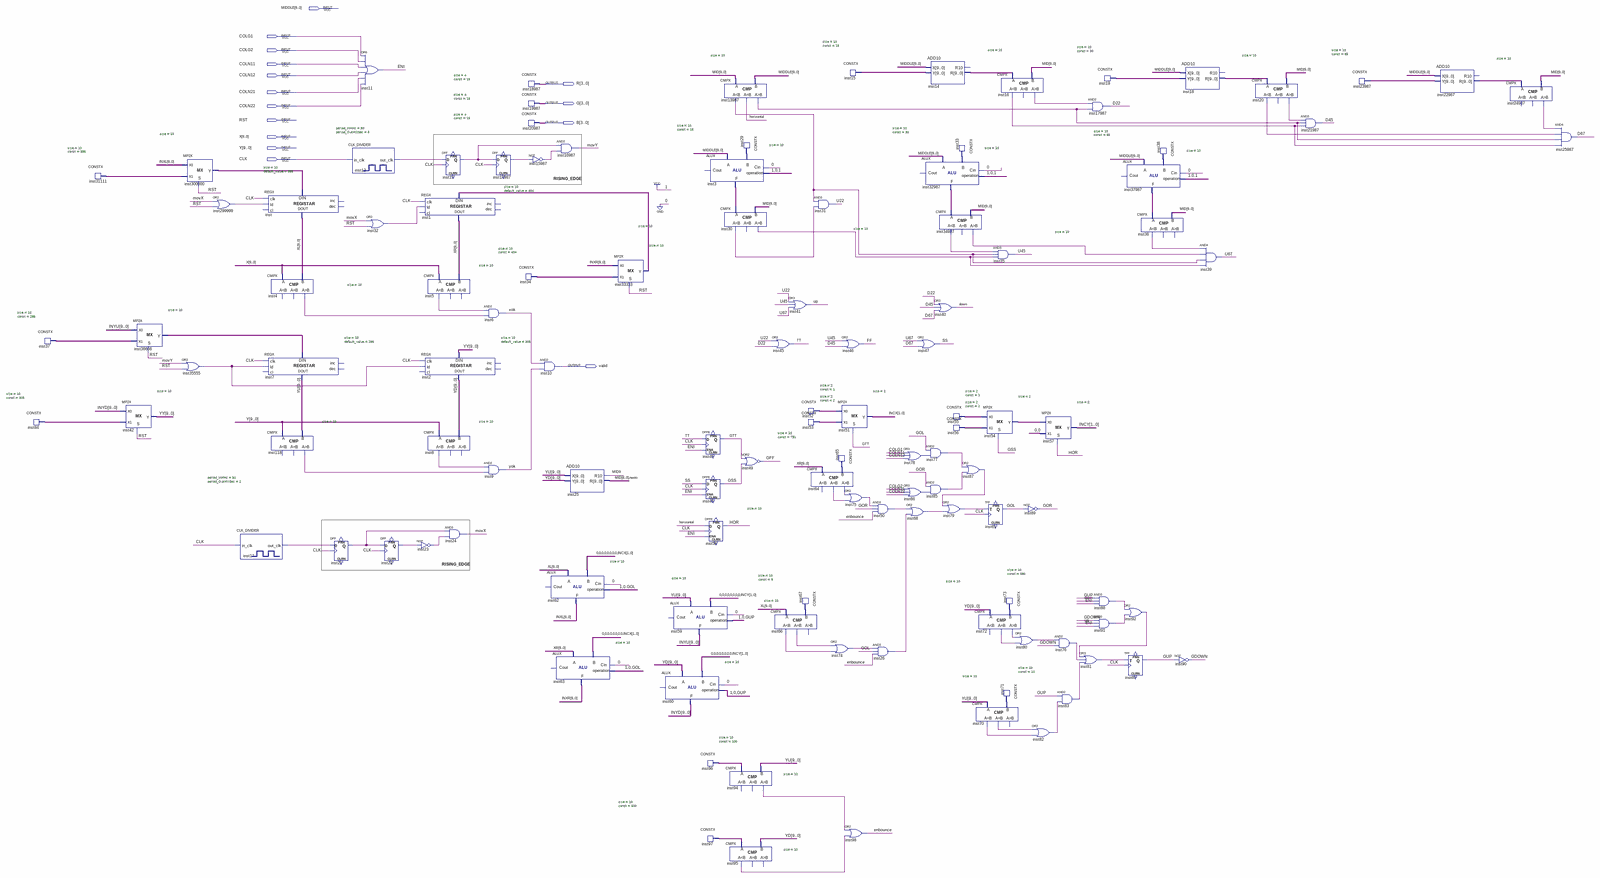
[diagram p0: schematic sheet, whole]
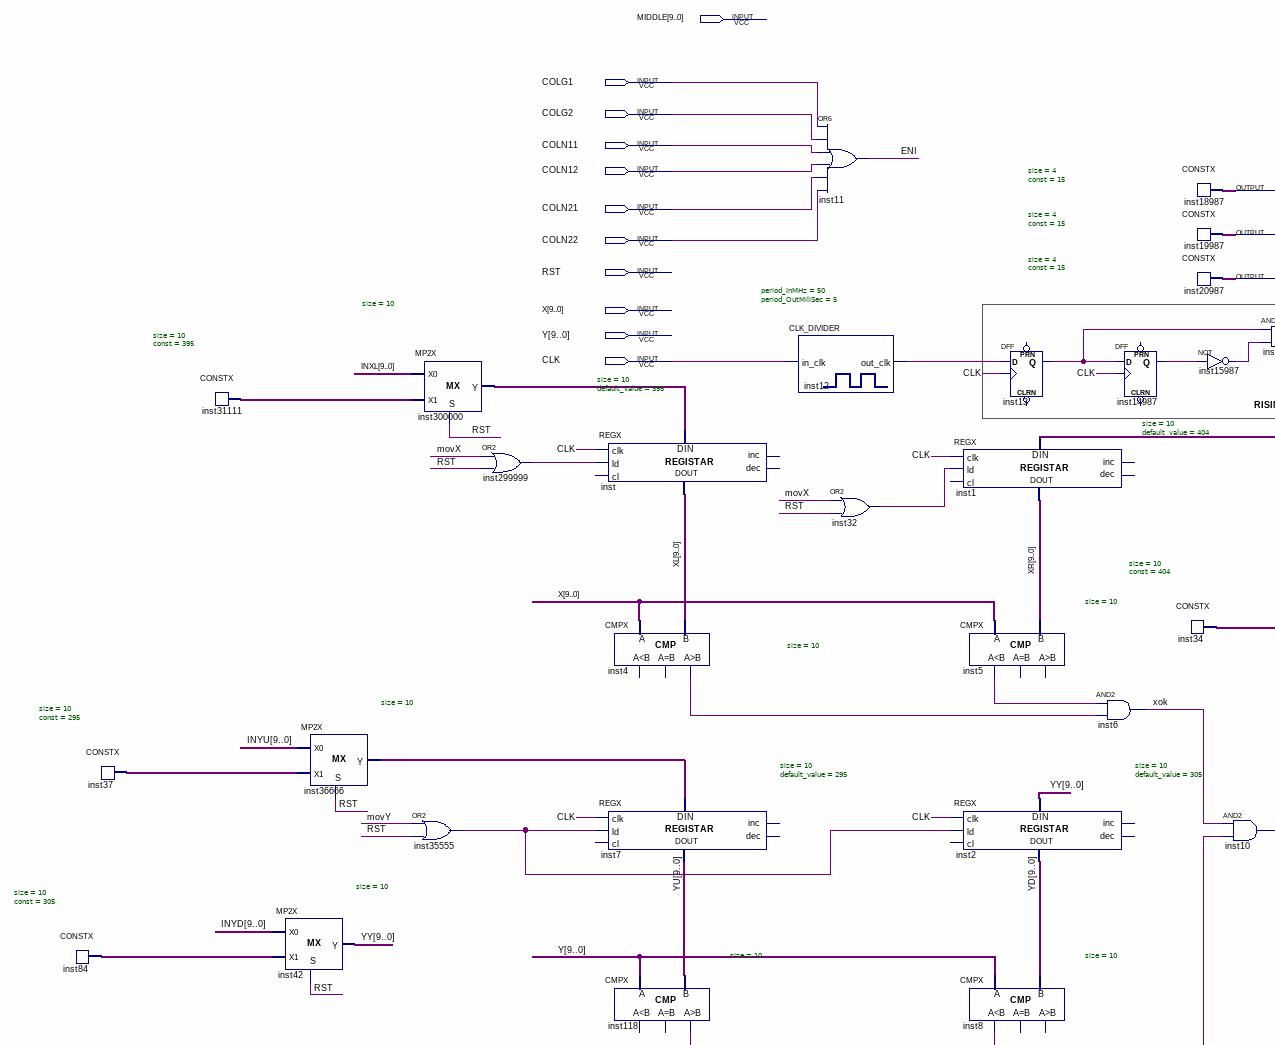
[diagram p1: schematic sheet, upper left part]
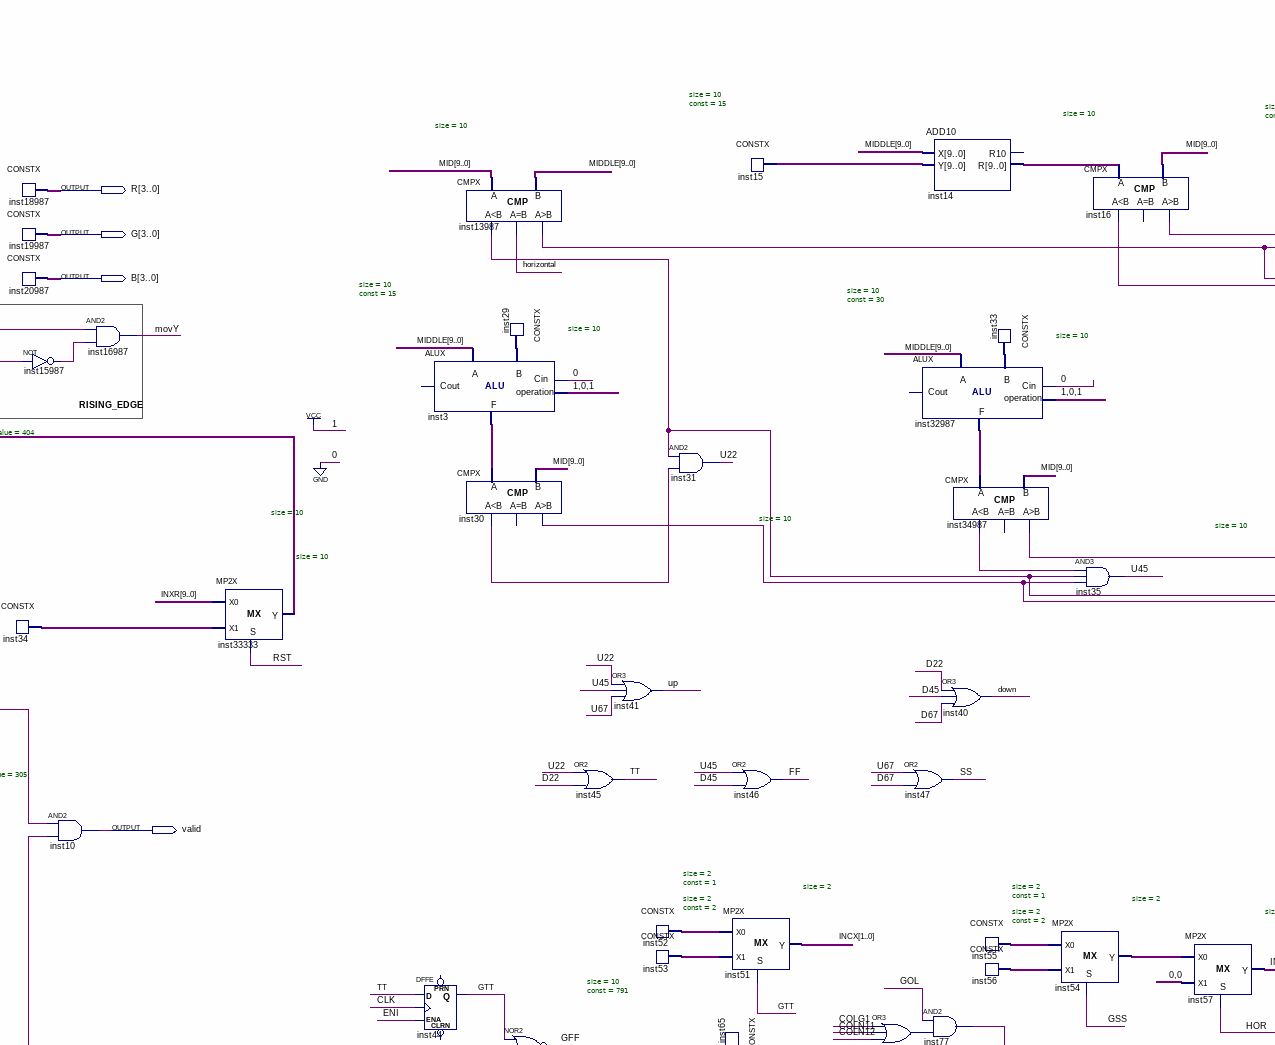
[diagram p2: schematic sheet, upper centre part]
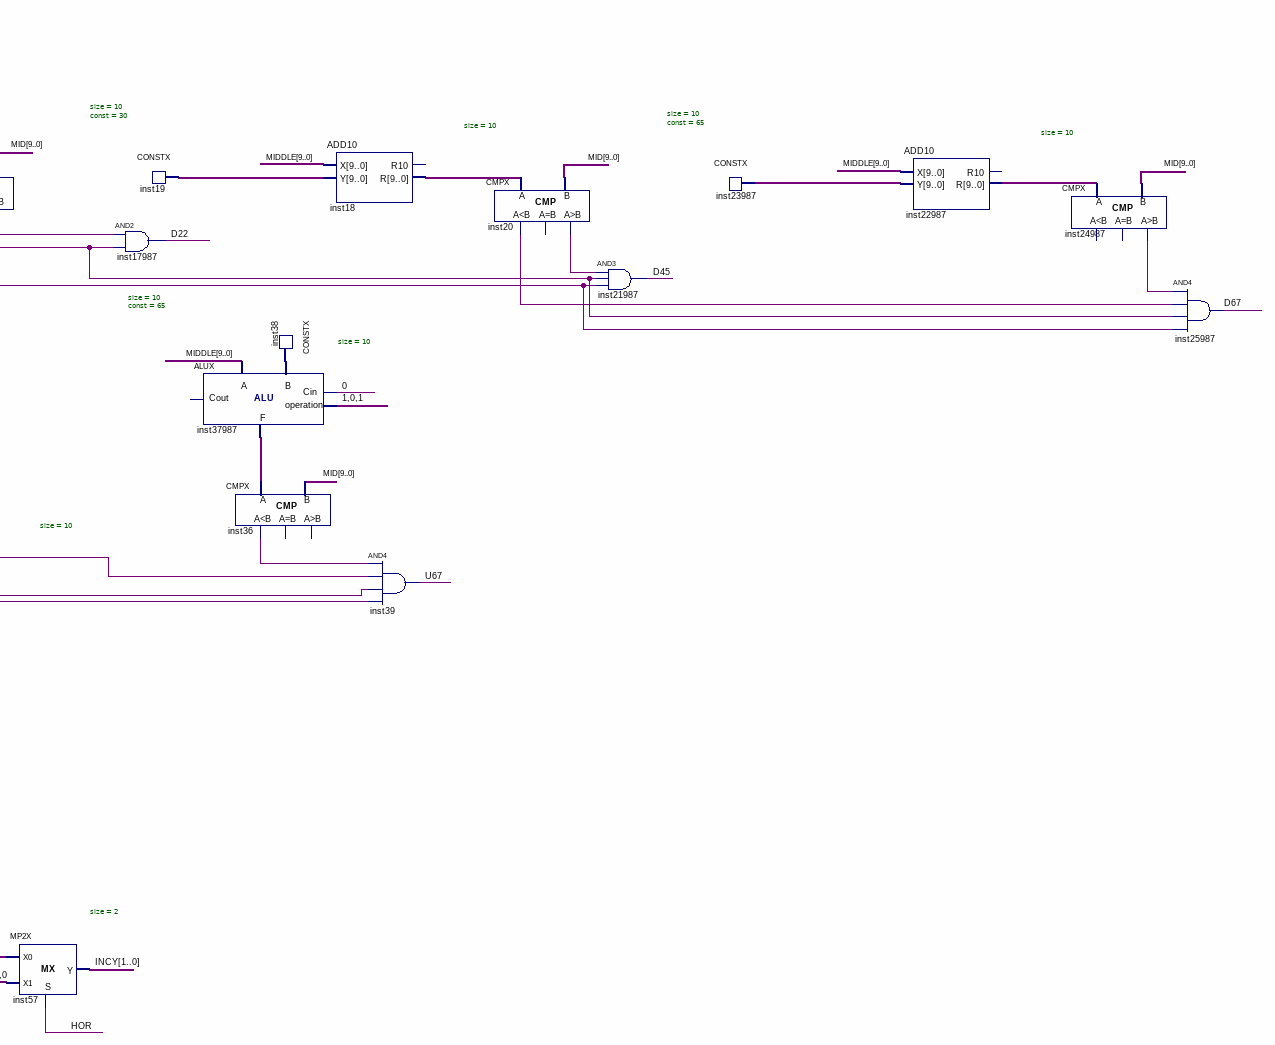
[diagram p3: schematic sheet, upper right part]
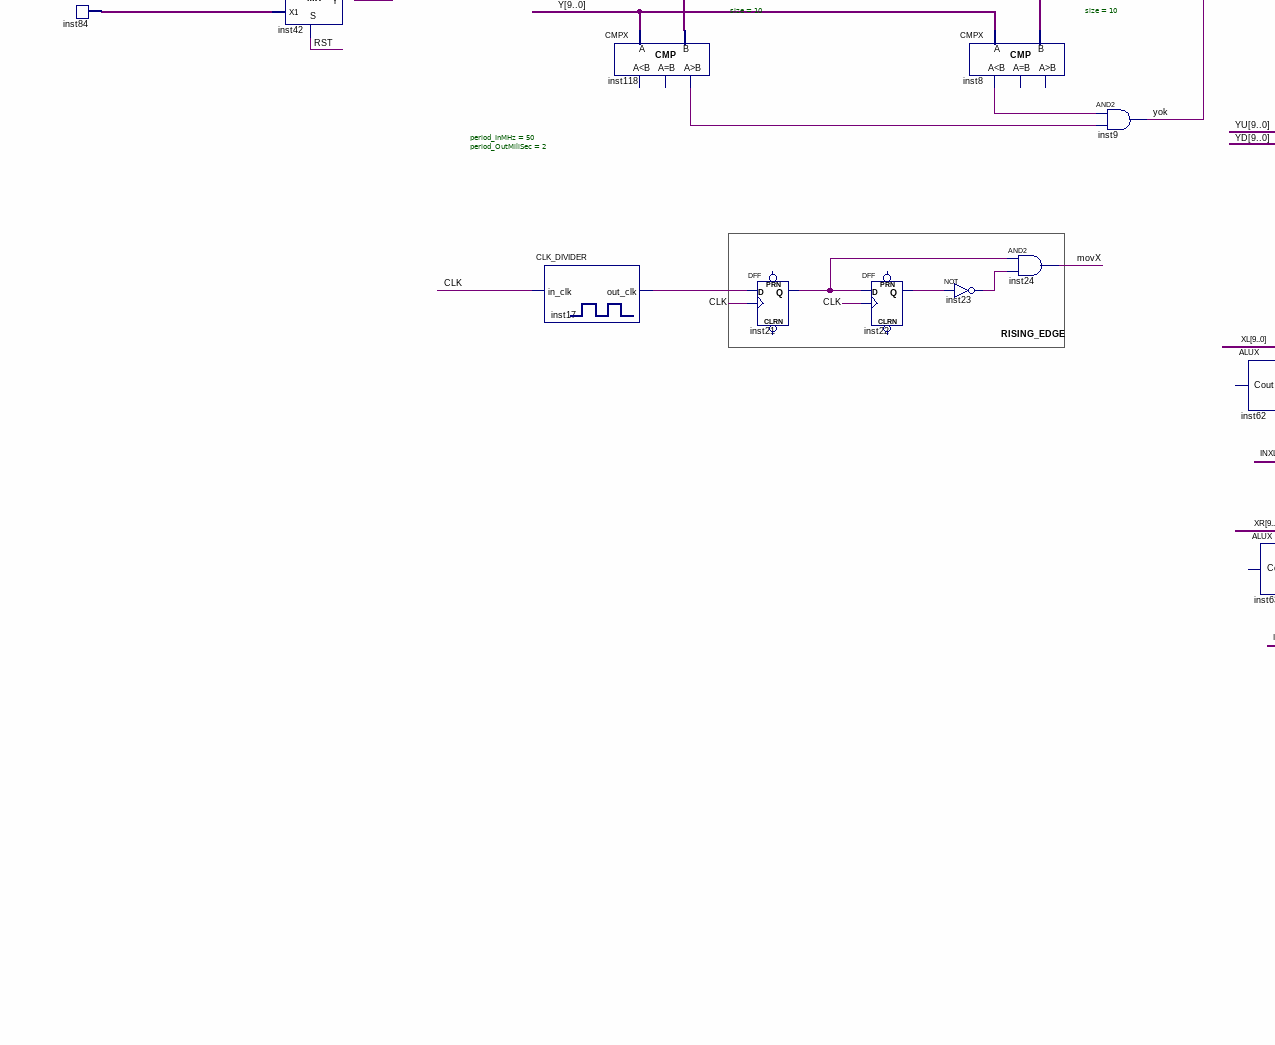
[diagram p4: schematic sheet, lower left part]
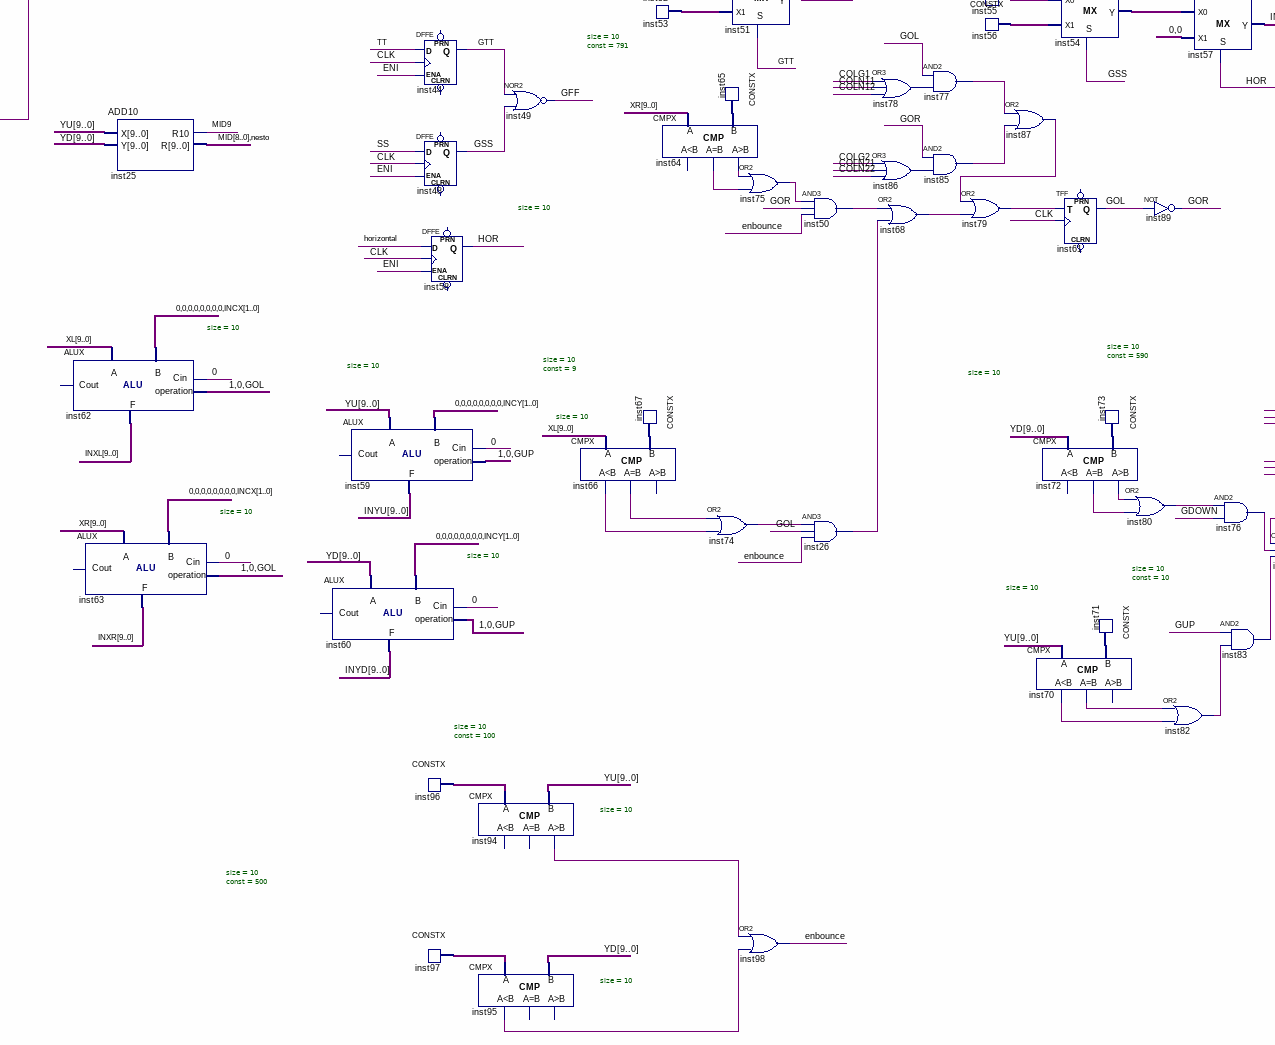
[diagram p5: schematic sheet, lower centre part]
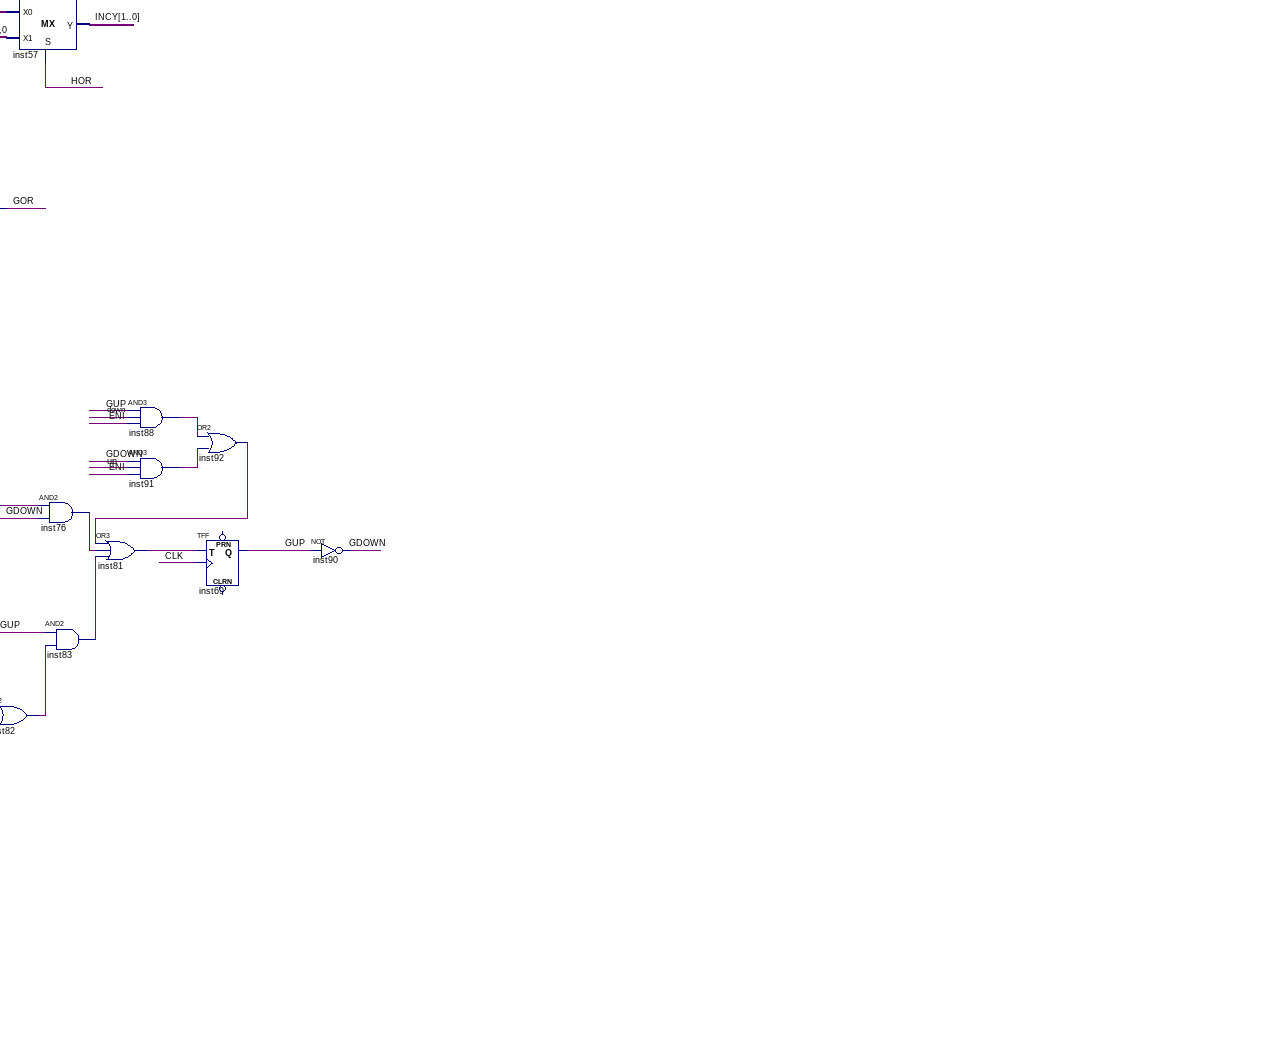
[diagram p6: schematic sheet, lower right part]
// Quartus schematic Loptica.bdf as structural Verilog: 118 symbols, 15 pins
module Loptica (
  input  [9:0] MIDDLE,
  input  COLG1,
  input  COLG2,
  input  COLN11,
  input  COLN12,
  input  COLN21,
  input  COLN22,
  input  RST,
  input  [9:0] X,
  input  [9:0] Y,
  input  CLK,
  output [3:0] R,
  output [3:0] G,
  output [3:0] B,
  output valid
);

  wire D22, D45, D67, down, enbounce, ENI, FF, GDOWN, GFF, GOL, GOR, GSS, GTT, GUP, HOR, horizontal,
       inst4_gr, inst5_ls, inst8_ls, inst12_out_clk, inst13_q, inst16_gr, inst16_ls, inst17_out_clk,
       inst20_gr, inst20_ls, inst21_q, inst22_q, inst23_out, inst26_out, inst30_gr, inst30_ls, inst32_out,
       inst36_ls, inst50_out, inst64_eq, inst64_gr, inst66_eq, inst66_ls, inst68_out, inst70_eq, inst70_ls,
       inst72_eq, inst72_gr, inst74_out, inst75_out, inst76_out, inst77_out, inst78_out, inst79_out,
       inst80_out, inst81_out, inst82_out, inst83_out, inst85_out, inst86_out, inst87_out, inst88_out,
       inst91_out, inst92_out, inst94_gr, inst95_ls, inst118_gr, inst13987_gr, inst13987_ls, inst14987_q,
       inst15987_out, inst24987_gr, inst34987_gr, inst34987_ls, inst35555_out, inst299999_out, movX, movY,
       nesto, SS, TT, U22, U45, U67, up, xok, yok;
  wire [1:0] INCX, INCY, inst52_data, inst53_data, inst54_y, inst55_data, inst56_data;
  wire [9:0] inst3_f, inst14_r, inst15_data, inst18_r, inst19_data, inst29_data, inst33_data, inst34_data,
       inst37_data, inst38_data, inst65_data, inst67_data, inst71_data, inst73_data, inst84_data,
       inst96_data, inst97_data, inst22987_r, inst23987_data, inst31111_data, inst32987_f, inst33333_y,
       inst36666_y, inst37987_f, inst300000_y, INXL, INXR, INYD, INYU, MID, XL, XR, YD, YU, YY;

  CONSTX #(.size(10), .\const (305)) inst84 (.data(inst84_data));
  CONSTX #(.size(10), .\const (295)) inst37 (.data(inst37_data));
  CONSTX #(.size(10), .\const (395)) inst31111 (.data(inst31111_data));
  MP2X #(.size(10)) inst36666 (.S(RST), .X0(INYU), .X1(inst37_data), .Y(inst36666_y));
  MP2X #(.size(10)) inst42 (.S(RST), .X0(INYD), .X1(inst84_data), .Y(YY));
  MP2X #(.size(10)) inst300000 (.S(RST), .X0(INXL), .X1(inst31111_data), .Y(inst300000_y));
  or inst35555 (inst35555_out, movY, RST);
  or inst299999 (inst299999_out, movX, RST);
  CLK_DIVIDER #(.period_InMHz(50), .period_OutMiliSec(2)) inst17 (.in_clk(CLK), .out_clk(inst17_out_clk));
  REGX #(.size(10), .default_value(395)) inst (
    .clk(CLK), .ld(inst299999_out), .data_in(inst300000_y), .data_out(XL));  // open: cl, inc, dec
  CMPX #(.size(10)) inst4 (.A(X), .B(XL), .gr(inst4_gr));  // open: ls, eq
  REGX #(.size(10), .default_value(295)) inst7 (
    .clk(CLK), .ld(inst35555_out), .data_in(inst36666_y), .data_out(YU));  // open: cl, inc, dec
  CMPX #(.size(10)) inst118 (.A(Y), .B(YU), .gr(inst118_gr));  // open: ls, eq
  DFF inst21 (.CLK(CLK), .D(inst17_out_clk), .Q(inst21_q));  // open: CLRN, PRN
  or inst11 (ENI, COLG1, COLG2, COLN11, COLN12, COLN21, COLN22);
  CLK_DIVIDER #(.period_InMHz(50), .period_OutMiliSec(5)) inst12 (.in_clk(CLK), .out_clk(inst12_out_clk));
  or inst32 (inst32_out, movX, RST);
  DFF inst22 (.CLK(CLK), .D(inst21_q), .Q(inst22_q));  // open: CLRN, PRN
  REGX #(.size(10), .default_value(404)) inst1 (
    .clk(CLK), .ld(inst32_out), .data_in(inst33333_y), .data_out(XR));  // open: cl, inc, dec
  CMPX #(.size(10)) inst5 (.A(X), .B(XR), .ls(inst5_ls));  // open: eq, gr
  REGX #(.size(10), .default_value(305)) inst2 (
    .clk(CLK), .ld(inst35555_out), .data_in(YY), .data_out(YD));  // open: cl, inc, dec
  CMPX #(.size(10)) inst8 (.A(Y), .B(YD), .ls(inst8_ls));  // open: eq, gr
  not inst23 (inst23_out, inst22_q);
  DFF inst13 (.CLK(CLK), .D(inst12_out_clk), .Q(inst13_q));  // open: CLRN, PRN
  and inst24 (movX, inst21_q, inst23_out);
  DFF inst14987 (.CLK(CLK), .D(inst13_q), .Q(inst14987_q));  // open: CLRN, PRN
  and inst6 (xok, inst5_ls, inst4_gr);
  and inst9 (yok, inst8_ls, inst118_gr);
  CONSTX #(.size(10), .\const (404)) inst34 (.data(inst34_data));
  CONSTX #(.size(4), .\const (15)) inst18987 (.data(R));
  CONSTX #(.size(4), .\const (15)) inst19987 (.data(G));
  CONSTX #(.size(4), .\const (15)) inst20987 (.data(B));
  not inst15987 (inst15987_out, inst14987_q);
  and inst10 (valid, xok, yok);
  and inst16987 (movY, inst13_q, inst15987_out);
  ALUX #(.size(10)) inst62 (.Cin(1'b0), .B({{8{1'b0}}, INCX}), .A(XL), .op({2'b10, GOL}), .F(INXL));  // open: Cout
  ALUX #(.size(10)) inst63 (.Cin(1'b0), .B({{8{1'b0}}, INCX}), .A(XR), .op({2'b10, GOL}), .F(INXR));  // open: Cout
  ADD10 inst25 (.X(YU), .Y(YD), .R10(MID[9]), .R({MID[8:0], nesto}));
  MP2X #(.size(10)) inst33333 (.S(RST), .X0(INXR), .X1(inst34_data), .Y(inst33333_y));
  ALUX #(.size(10)) inst59 (.Cin(1'b0), .B({{8{1'b0}}, INCY}), .A(YU), .op({2'b10, GUP}), .F(INYU));  // open: Cout
  ALUX #(.size(10)) inst60 (.Cin(1'b0), .B({{8{1'b0}}, INCY}), .A(YD), .op({2'b10, GUP}), .F(INYD));  // open: Cout
  CMPX #(.size(10)) inst13987 (.A(MID), .B(MIDDLE), .ls(inst13987_ls), .eq(horizontal), .gr(inst13987_gr));
  ALUX #(.size(10)) inst3 (.Cin(1'b0), .B(inst29_data), .A(MIDDLE), .op(3'b101), .F(inst3_f));  // open: Cout
  CMPX #(.size(10)) inst30 (.A(inst3_f), .B(MID), .ls(inst30_ls), .gr(inst30_gr));  // open: eq
  DFFE inst44 (.D(TT), .CLK(CLK), .ENA(ENI), .Q(GTT));  // open: PRN, CLRN
  DFFE inst48 (.D(SS), .CLK(CLK), .ENA(ENI), .Q(GSS));  // open: PRN, CLRN
  DFFE inst58 (.D(horizontal), .CLK(CLK), .ENA(ENI), .Q(HOR));  // open: PRN, CLRN
  CONSTX #(.size(10), .\const (100)) inst96 (.data(inst96_data));
  CONSTX #(.size(10), .\const (500)) inst97 (.data(inst97_data));
  CONSTX #(.size(10), .\const (15)) inst29 (.data(inst29_data));
  nor inst49 (GFF, GTT, GSS);
  CMPX #(.size(10)) inst94 (.A(inst96_data), .B(YU), .gr(inst94_gr));  // open: ls, eq
  CMPX #(.size(10)) inst95 (.A(inst97_data), .B(YD), .ls(inst95_ls));  // open: eq, gr
  or inst45 (TT, U22, D22);
  CMPX #(.size(10)) inst66 (.A(XL), .B(inst67_data), .ls(inst66_ls), .eq(inst66_eq));  // open: gr
  or inst41 (up, U22, U45, U67);
  CONSTX #(.size(2), .\const (1)) inst52 (.data(inst52_data));
  CONSTX #(.size(2), .\const (2)) inst53 (.data(inst53_data));
  CMPX #(.size(10)) inst64 (.A(XR), .B(inst65_data), .eq(inst64_eq), .gr(inst64_gr));  // open: ls
  CONSTX #(.size(10), .\const (9)) inst67 (.data(inst67_data));
  and inst31 (U22, inst13987_ls, inst30_ls);
  or inst74 (inst74_out, inst66_eq, inst66_ls);
  CONSTX #(.size(10), .\const (15)) inst15 (.data(inst15_data));
  or inst46 (FF, U45, D45);
  MP2X #(.size(2)) inst51 (.S(GTT), .X0(inst52_data), .X1(inst53_data), .Y(INCX));
  CONSTX #(.size(10), .\const (791)) inst65 (.data(inst65_data));
  or inst75 (inst75_out, inst64_gr, inst64_eq);
  or inst98 (enbounce, inst94_gr, inst95_ls);
  and inst50 (inst50_out, inst75_out, GOR, enbounce);
  and inst26 (inst26_out, inst74_out, GOL, enbounce);
  ALUX #(.size(10)) inst32987 (.Cin(1'b0), .B(inst33_data), .A(MIDDLE), .op(3'b101), .F(inst32987_f));  // open: Cout
  or inst47 (SS, U67, D67);
  or inst78 (inst78_out, COLG1, COLN11, COLN12);
  or inst86 (inst86_out, COLG2, COLN21, COLN22);
  or inst68 (inst68_out, inst50_out, inst26_out);
  ADD10 inst14 (.X(MIDDLE), .Y(inst15_data), .R(inst14_r));  // open: R10
  CMPX #(.size(10)) inst34987 (.A(inst32987_f), .B(MID), .ls(inst34987_ls), .gr(inst34987_gr));  // open: eq
  or inst40 (down, D22, D45, D67);
  and inst77 (inst77_out, GOL, inst78_out);
  and inst85 (inst85_out, GOR, inst86_out);
  or inst79 (inst79_out, inst87_out, inst68_out);
  CONSTX #(.size(10), .\const (30)) inst33 (.data(inst33_data));
  CONSTX #(.size(2), .\const (1)) inst55 (.data(inst55_data));
  CONSTX #(.size(2), .\const (2)) inst56 (.data(inst56_data));
  or inst87 (inst87_out, inst77_out, inst85_out);
  MP2X #(.size(2)) inst54 (.S(GSS), .X0(inst55_data), .X1(inst56_data), .Y(inst54_y));
  TFF inst61 (.T(inst79_out), .CLK(CLK), .Q(GOL));  // open: PRN, CLRN
  CMPX #(.size(10)) inst72 (.A(YD), .B(inst73_data), .eq(inst72_eq), .gr(inst72_gr));  // open: ls
  CMPX #(.size(10)) inst70 (.A(YU), .B(inst71_data), .ls(inst70_ls), .eq(inst70_eq));  // open: gr
  CMPX #(.size(10)) inst16 (.A(inst14_r), .B(MID), .ls(inst16_ls), .gr(inst16_gr));  // open: eq
  and inst35 (U45, inst34987_ls, inst13987_ls, inst30_gr);
  CONSTX #(.size(10), .\const (590)) inst73 (.data(inst73_data));
  CONSTX #(.size(10), .\const (10)) inst71 (.data(inst71_data));
  not inst89 (GOR, GOL);
  or inst80 (inst80_out, inst72_gr, inst72_eq);
  or inst82 (inst82_out, inst70_eq, inst70_ls);
  MP2X #(.size(2)) inst57 (.S(HOR), .X0(inst54_y), .X1(2'b00), .Y(INCY));
  and inst76 (inst76_out, inst80_out, GDOWN);
  and inst83 (inst83_out, GUP, inst82_out);
  CONSTX #(.size(10), .\const (30)) inst19 (.data(inst19_data));
  and inst17987 (D22, inst16_gr, inst13987_gr);
  and inst88 (inst88_out, GUP, down, ENI);
  and inst91 (inst91_out, GDOWN, up, ENI);
  or inst81 (inst81_out, inst92_out, inst76_out, inst83_out);
  ALUX #(.size(10)) inst37987 (.Cin(1'b0), .B(inst38_data), .A(MIDDLE), .op(3'b101), .F(inst37987_f));  // open: Cout
  CMPX #(.size(10)) inst36 (.A(inst37987_f), .B(MID), .ls(inst36_ls));  // open: eq, gr
  or inst92 (inst92_out, inst88_out, inst91_out);
  TFF inst69 (.T(inst81_out), .CLK(CLK), .Q(GUP));  // open: PRN, CLRN
  CONSTX #(.size(10), .\const (65)) inst38 (.data(inst38_data));
  ADD10 inst18 (.X(MIDDLE), .Y(inst19_data), .R(inst18_r));  // open: R10
  not inst90 (GDOWN, GUP);
  and inst39 (U67, inst36_ls, inst34987_gr, inst13987_ls, inst30_gr);
  CMPX #(.size(10)) inst20 (.A(inst18_r), .B(MID), .ls(inst20_ls), .gr(inst20_gr));  // open: eq
  and inst21987 (D45, inst20_gr, inst13987_gr, inst16_ls);
  CONSTX #(.size(10), .\const (65)) inst23987 (.data(inst23987_data));
  ADD10 inst22987 (.X(MIDDLE), .Y(inst23987_data), .R(inst22987_r));  // open: R10
  CMPX #(.size(10)) inst24987 (.A(inst22987_r), .B(MID), .gr(inst24987_gr));  // open: ls, eq
  and inst25987 (D67, inst24987_gr, inst20_ls, inst13987_gr, inst16_ls);

  // Notes on the sheet:
  //   RISING_EDGE
  //   RISING_EDGE
endmodule
